# Altium project CurrentShuntAmp.PrjPcb
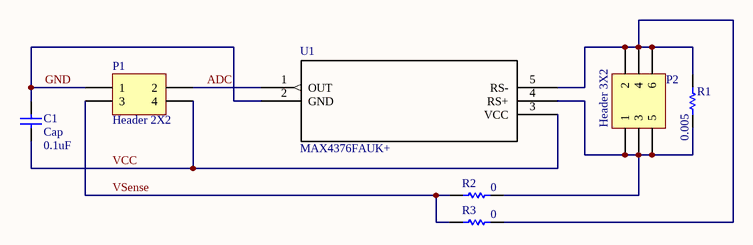
[diagram p0: Sheet1.SchDoc]
1 sheet, 7 parts. Net scope: global (net labels, ports and power ports of the same name join across sheets).
Board file: CurrentShuntAmp.PcbDoc

## Sheet Sheet1.SchDoc
size A4

### Parts
C1  Cap  value 0.1uF  [C0805]
P1  Header 2X2  [HDR2X2]
P2  Header 3X2  [HDR2X3]
R1  value 0.005  [C1206]  (hidden comment: Res1)
R2  value 0  [6-0805_M]  (hidden comment: Res1)
R3  value 0  [6-0805_M]  (hidden comment: Res1)
U1  MAX4376FAUK+  [21-0057F]

### Nets
ADC: P1.2 U1.1(OUT)
GND: C1.2 P1.1 U1.2(GND)
VCC: C1.1 P1.4 U1.3(VCC)
VSense: P1.3 R2.2 R3.2
NetP2_1: P2.1 P2.3 P2.5 R1.1 R2.1 U1.4(RS+)
NetP2_2: P2.2 P2.4 P2.6 R1.2 R3.1 U1.5(RS-)

### Library data of the parts
C1 = Cap Semi: Capacitor (Semiconductor SIM Model); Published: 8-Jun-2000; LatestRevisionDate: 29-May-2009; LatestRevisionNote: IPC-7351 Footprint Added.; PackageReference: C1206; Publisher: Altium Limited; PackageDescription: Chip Capacitor
P1 = Header 2X2: Header, 2-Pin, Dual row; LatestRevisionDate: 17-Jul-2002; LatestRevisionNote: Re-released for DXP Platform.; Publisher: Altium Limited
P2 = Header 3X2: Header, 3-Pin, Dual row; LatestRevisionDate: 17-Jul-2002; LatestRevisionNote: Re-released for DXP Platform.; Publisher: Altium Limited
R1-R3 = Res1: Resistor; Published: 8-Jun-2000; LatestRevisionDate: 17-Jul-2002; LatestRevisionNote: Re-released for DXP Platform.; PackageReference: AXIAL-0.3; Publisher: Altium Limited; PackageDescription: Axial Device, Thru-Hole; 2 Leads; 0.3 in Pin Spacing
U1 = MAX4376FAUK+: Imported; Vendor: MAXIM; Manufacturer_Part_Number: max4376fauk+; RefDes: RefDes; Type: DEV; Value: Value